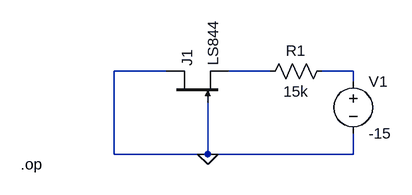
[diagram p0: schematic Draft15.asc]
Draft15.asc, the LTspice schematic file:
Version 4
SHEET 1 880 680
WIRE 144 80 64 80
WIRE 304 80 240 80
WIRE 432 80 384 80
WIRE 432 96 432 80
WIRE 64 208 64 80
WIRE 208 208 208 128
WIRE 208 208 64 208
WIRE 432 208 432 176
WIRE 432 208 208 208
FLAG 208 208 0
DATAFLAG 432 80 ""
SYMBOL res 288 96 R270
WINDOW 0 32 56 VTop 2
WINDOW 3 0 56 VBottom 2
SYMATTR InstName R1
SYMATTR Value 15k
SYMBOL njf 144 128 R270
SYMATTR InstName J1
SYMATTR Value LS844
SYMBOL voltage 432 80 R0
SYMATTR InstName V1
SYMATTR Value -15
TEXT -80 224 Left 2 !.op

The netlist it stands for:
* Draft15.asc
R1 N001 N002 15k
J1 0 0 N001 LS844
V1 N002 0 -15
.model NJF NJF
.model PJF PJF
.lib standard.jft
.op
.backanno
.end